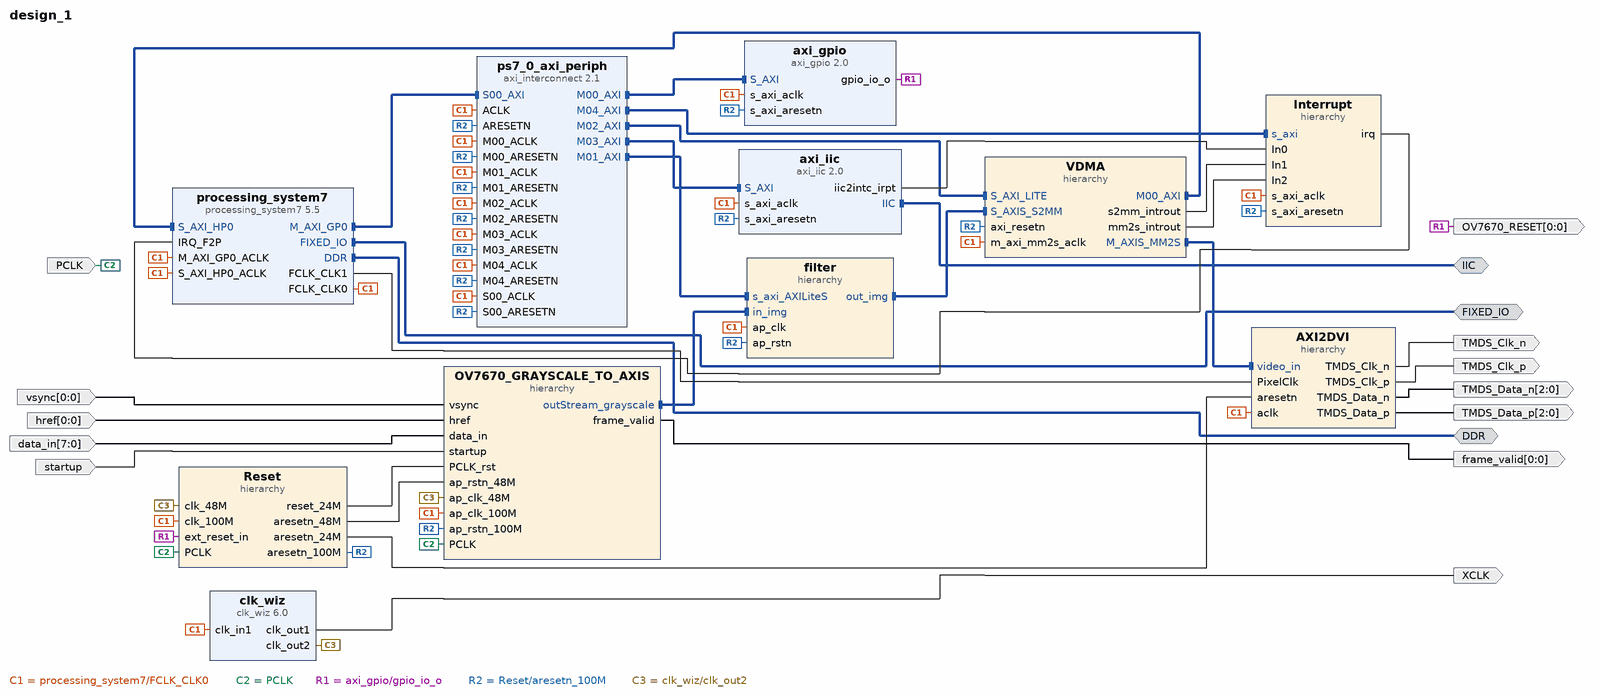
[diagram p0: block diagram of the top level]
# Vivado block design design_1, xc7z020clg400-1, Vivado 2019.1
create_bd_design design_1

create_bd_intf_port -mode Master -vlnv xilinx.com:interface:ddrx_rtl:1.0 DDR
create_bd_intf_port -mode Master -vlnv xilinx.com:display_processing_system7:fixedio_rtl:1.0 FIXED_IO
create_bd_intf_port -mode Master -vlnv xilinx.com:interface:iic_rtl:1.0 IIC
create_bd_port -dir O -type clk TMDS_Clk_p
create_bd_port -dir O -type clk TMDS_Clk_n
create_bd_port -dir O -from 2 -to 0 TMDS_Data_p
create_bd_port -dir O -from 2 -to 0 TMDS_Data_n
create_bd_port -dir O -type clk XCLK
set_property -dict {CONFIG.FREQ_HZ 24000000} [get_bd_ports XCLK]
create_bd_port -dir I -from 0 -to 0 -type data vsync
set_property -dict [list \
  CONFIG.LAYERED_METADATA {xilinx.com:interface:datatypes:1.0 {DATA {datatype {name {attribs {resolve_type immediate dependency {} format string minimum {} maximum {}} value {}} bitwidth {attribs {resolve_type immediate dependency {} format long minimum {} maximum {}} value 1} bitoffset {attribs {resolve_type immediate dependency {} format long minimum {} maximum {}} value 0} integer {signed {attribs {resolve_type immediate dependency {} format bool minimum {} maximum {}} value false}}}}}} \
] [get_bd_ports vsync]
create_bd_port -dir I -from 0 -to 0 -type data href
set_property -dict [list \
  CONFIG.LAYERED_METADATA {xilinx.com:interface:datatypes:1.0 {DATA {datatype {name {attribs {resolve_type immediate dependency {} format string minimum {} maximum {}} value {}} bitwidth {attribs {resolve_type immediate dependency {} format long minimum {} maximum {}} value 1} bitoffset {attribs {resolve_type immediate dependency {} format long minimum {} maximum {}} value 0} integer {signed {attribs {resolve_type immediate dependency {} format bool minimum {} maximum {}} value false}}}}}} \
] [get_bd_ports href]
create_bd_port -dir I -from 7 -to 0 -type data data_in
set_property -dict [list \
  CONFIG.LAYERED_METADATA {xilinx.com:interface:datatypes:1.0 {DATA {datatype {name {attribs {resolve_type immediate dependency {} format string minimum {} maximum {}} value {}} bitwidth {attribs {resolve_type immediate dependency {} format long minimum {} maximum {}} value 8} bitoffset {attribs {resolve_type immediate dependency {} format long minimum {} maximum {}} value 0} integer {signed {attribs {resolve_type immediate dependency {} format bool minimum {} maximum {}} value false}}}}}} \
] [get_bd_ports data_in]
create_bd_port -dir I -type clk PCLK
set_property -dict {CONFIG.FREQ_HZ 24000000} [get_bd_ports PCLK]
create_bd_port -dir O -from 0 -to 0 OV7670_RESET
create_bd_port -dir O -from 0 -to 0 -type data frame_valid
create_bd_port -dir I -type rst startup
set_property -dict {CONFIG.POLARITY ACTIVE_LOW} [get_bd_ports startup]

create_bd_cell -type ip -vlnv xilinx.com:ip:processing_system7:5.5 processing_system7
set_property -dict [list \
  CONFIG.PCW_APU_PERIPHERAL_FREQMHZ 650 \
  CONFIG.PCW_CRYSTAL_PERIPHERAL_FREQMHZ 50 \
  CONFIG.PCW_ENET0_ENET0_IO {MIO 16 .. 27} \
  CONFIG.PCW_ENET0_GRP_MDIO_ENABLE 1 \
  CONFIG.PCW_ENET0_GRP_MDIO_IO {MIO 52 .. 53} \
  CONFIG.PCW_ENET0_PERIPHERAL_ENABLE 1 \
  CONFIG.PCW_ENET0_RESET_ENABLE 1 \
  CONFIG.PCW_ENET0_RESET_IO {MIO 9} \
  CONFIG.PCW_ENET_RESET_ENABLE 1 \
  CONFIG.PCW_ENET_RESET_SELECT {Share reset pin} \
  CONFIG.PCW_EN_CLK1_PORT 1 \
  CONFIG.PCW_FPGA0_PERIPHERAL_FREQMHZ 100 \
  CONFIG.PCW_FPGA1_PERIPHERAL_FREQMHZ 40 \
  CONFIG.PCW_FPGA_FCLK1_ENABLE 1 \
  CONFIG.PCW_GPIO_MIO_GPIO_ENABLE 1 \
  CONFIG.PCW_GPIO_MIO_GPIO_IO MIO \
  CONFIG.PCW_I2C_RESET_ENABLE 1 \
  CONFIG.PCW_IRQ_F2P_INTR 1 \
  CONFIG.PCW_M_AXI_GP0_FREQMHZ 10 \
  CONFIG.PCW_PERIPHERAL_BOARD_PRESET part0 \
  CONFIG.PCW_PRESET_BANK1_VOLTAGE {LVCMOS 1.8V} \
  CONFIG.PCW_QSPI_GRP_FBCLK_ENABLE 1 \
  CONFIG.PCW_QSPI_GRP_FBCLK_IO {MIO 8} \
  CONFIG.PCW_QSPI_GRP_SINGLE_SS_ENABLE 1 \
  CONFIG.PCW_QSPI_GRP_SINGLE_SS_IO {MIO 1 .. 6} \
  CONFIG.PCW_QSPI_PERIPHERAL_ENABLE 1 \
  CONFIG.PCW_QSPI_QSPI_IO {MIO 1 .. 6} \
  CONFIG.PCW_SD0_GRP_CD_ENABLE 1 \
  CONFIG.PCW_SD0_GRP_CD_IO {MIO 47} \
  CONFIG.PCW_SD0_GRP_WP_ENABLE 0 \
  CONFIG.PCW_SD0_PERIPHERAL_ENABLE 1 \
  CONFIG.PCW_SD0_SD0_IO {MIO 40 .. 45} \
  CONFIG.PCW_SDIO_PERIPHERAL_FREQMHZ 50 \
  CONFIG.PCW_SINGLE_QSPI_DATA_MODE x4 \
  CONFIG.PCW_S_AXI_HP0_FREQMHZ 10 \
  CONFIG.PCW_UART0_PERIPHERAL_ENABLE 1 \
  CONFIG.PCW_UART0_UART0_IO {MIO 14 .. 15} \
  CONFIG.PCW_UART1_PERIPHERAL_ENABLE 0 \
  CONFIG.PCW_UART_PERIPHERAL_FREQMHZ 100 \
  CONFIG.PCW_UIPARAM_DDR_BUS_WIDTH {16 Bit} \
  CONFIG.PCW_UIPARAM_DDR_FREQ_MHZ 525 \
  CONFIG.PCW_UIPARAM_DDR_PARTNO {MT41J256M16 RE-125} \
  CONFIG.PCW_USB0_PERIPHERAL_ENABLE 1 \
  CONFIG.PCW_USB0_RESET_ENABLE 1 \
  CONFIG.PCW_USB0_RESET_IO {MIO 46} \
  CONFIG.PCW_USB0_USB0_IO {MIO 28 .. 39} \
  CONFIG.PCW_USB_RESET_ENABLE 1 \
  CONFIG.PCW_USB_RESET_SELECT {Share reset pin} \
  CONFIG.PCW_USE_FABRIC_INTERRUPT 1 \
  CONFIG.PCW_USE_S_AXI_HP0 1 \
] [get_bd_cells processing_system7]
# 495 more settings of processing_system7 are not shown: defaults, MIO pin electricals, DDR timing, and values the tool derives
create_bd_cell -type ip -vlnv xilinx.com:ip:axi_interconnect:2.1 ps7_0_axi_periph
set_property -dict {CONFIG.NUM_MI 5} [get_bd_cells ps7_0_axi_periph]
create_bd_cell -type hier filter
create_bd_cell -type ip -vlnv xilinx.com:ip:clk_wiz:6.0 clk_wiz
set_property -dict [list \
  CONFIG.CLKOUT1_JITTER 320.117 \
  CONFIG.CLKOUT1_PHASE_ERROR 301.601 \
  CONFIG.CLKOUT1_REQUESTED_OUT_FREQ 24 \
  CONFIG.CLKOUT2_JITTER 281.382 \
  CONFIG.CLKOUT2_PHASE_ERROR 301.601 \
  CONFIG.CLKOUT2_REQUESTED_OUT_FREQ 48.000 \
  CONFIG.CLKOUT2_USED true \
  CONFIG.MMCM_CLKFBOUT_MULT_F 48.000 \
  CONFIG.MMCM_CLKOUT0_DIVIDE_F 40.000 \
  CONFIG.MMCM_CLKOUT1_DIVIDE 20 \
  CONFIG.MMCM_DIVCLK_DIVIDE 5 \
  CONFIG.NUM_OUT_CLKS 2 \
  CONFIG.USE_LOCKED false \
  CONFIG.USE_RESET false \
] [get_bd_cells clk_wiz]
create_bd_cell -type ip -vlnv xilinx.com:ip:axi_gpio:2.0 axi_gpio
set_property -dict {CONFIG.C_ALL_OUTPUTS 1 CONFIG.C_DOUT_DEFAULT 0x00000001 CONFIG.C_GPIO_WIDTH 1} [get_bd_cells axi_gpio]
create_bd_cell -type hier Interrupt
create_bd_cell -type hier AXI2DVI
create_bd_cell -type hier OV7670_GRAYSCALE_TO_AXIS
create_bd_cell -type ip -vlnv xilinx.com:ip:axi_iic:2.0 axi_iic
set_property -dict {CONFIG.IIC_BOARD_INTERFACE Custom CONFIG.USE_BOARD_FLOW true} [get_bd_cells axi_iic]
create_bd_cell -type hier Reset
create_bd_cell -type hier VDMA

# ---- hierarchy /filter ----
current_bd_instance /filter
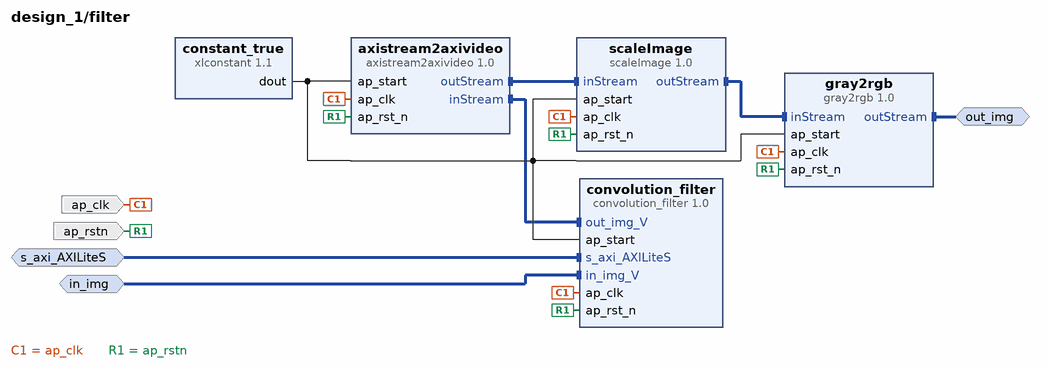
[diagram p1: block diagram inside /filter]
create_bd_intf_pin -mode Slave -vlnv xilinx.com:interface:aximm_rtl:1.0 s_axi_AXILiteS
create_bd_intf_pin -mode Slave -vlnv xilinx.com:interface:axis_rtl:1.0 in_img
create_bd_intf_pin -mode Master -vlnv xilinx.com:interface:axis_rtl:1.0 out_img
create_bd_pin -dir I -type clk ap_clk
create_bd_pin -dir I -type rst ap_rstn

create_bd_cell -type ip -vlnv xilinx.com:ip:xlconstant:1.1 constant_true
create_bd_cell -type ip -vlnv xilinx.com:hls:scaleImage:1.0 scaleImage
create_bd_cell -type ip -vlnv xilinx.com:hls:gray2rgb:1.0 gray2rgb
create_bd_cell -type ip -vlnv xilinx.com:hls:axistream2axivideo:1.0 axistream2axivideo
create_bd_cell -type ip -vlnv xilinx.com:hls:convolution_filter:1.0 convolution_filter

# ---- hierarchy /Interrupt ----
current_bd_instance /Interrupt
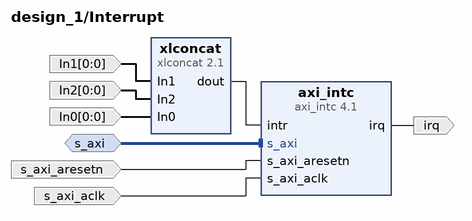
[diagram p2: block diagram inside /Interrupt]
create_bd_intf_pin -mode Slave -vlnv xilinx.com:interface:aximm_rtl:1.0 s_axi
create_bd_pin -dir I -type rst s_axi_aresetn
create_bd_pin -dir O irq
create_bd_pin -dir I -type clk s_axi_aclk
create_bd_pin -dir I -from 0 -to 0 In1
create_bd_pin -dir I -from 0 -to 0 In2
create_bd_pin -dir I -from 0 -to 0 In0

create_bd_cell -type ip -vlnv xilinx.com:ip:axi_intc:4.1 axi_intc
create_bd_cell -type ip -vlnv xilinx.com:ip:xlconcat:2.1 xlconcat
set_property -dict {CONFIG.NUM_PORTS 3} [get_bd_cells xlconcat]

# ---- hierarchy /AXI2DVI ----
current_bd_instance /AXI2DVI
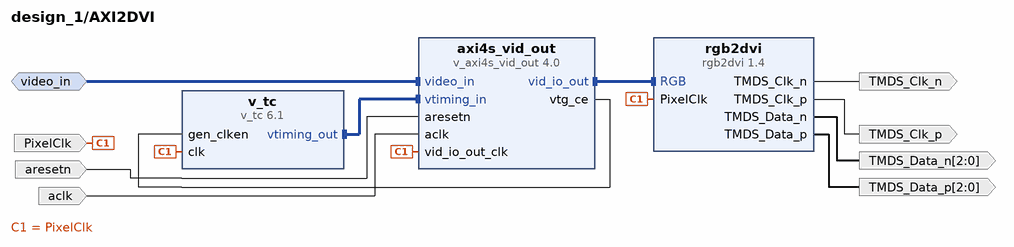
[diagram p3: block diagram inside /AXI2DVI]
create_bd_intf_pin -mode Slave -vlnv xilinx.com:interface:axis_rtl:1.0 video_in
create_bd_pin -dir I -type clk PixelClk
create_bd_pin -dir O -type clk TMDS_Clk_n
create_bd_pin -dir O -from 2 -to 0 TMDS_Data_p
create_bd_pin -dir O -from 2 -to 0 TMDS_Data_n
create_bd_pin -dir O -type clk TMDS_Clk_p
create_bd_pin -dir I -type rst aresetn
create_bd_pin -dir I -type clk aclk

create_bd_cell -type ip -vlnv digilentinc.com:ip:rgb2dvi:1.4 rgb2dvi
set_property -dict {CONFIG.kClkRange 3} [get_bd_cells rgb2dvi]
create_bd_cell -type ip -vlnv xilinx.com:ip:v_axi4s_vid_out:4.0 axi4s_vid_out
set_property -dict [list \
  CONFIG.C_ADDR_WIDTH 10 \
  CONFIG.C_HAS_ASYNC_CLK 1 \
  CONFIG.C_HYSTERESIS_LEVEL 1023 \
  CONFIG.C_S_AXIS_VIDEO_FORMAT 2 \
] [get_bd_cells axi4s_vid_out]
create_bd_cell -type ip -vlnv xilinx.com:ip:v_tc:6.1 v_tc
set_property -dict [list \
  CONFIG.HAS_AXI4_LITE false \
  CONFIG.VIDEO_MODE 800x600p \
  CONFIG.enable_detection false \
  CONFIG.max_clocks_per_line 2048 \
  CONFIG.max_lines_per_frame 2048 \
] [get_bd_cells v_tc]

# ---- hierarchy /OV7670_GRAYSCALE_TO_AXIS ----
current_bd_instance /OV7670_GRAYSCALE_TO_AXIS
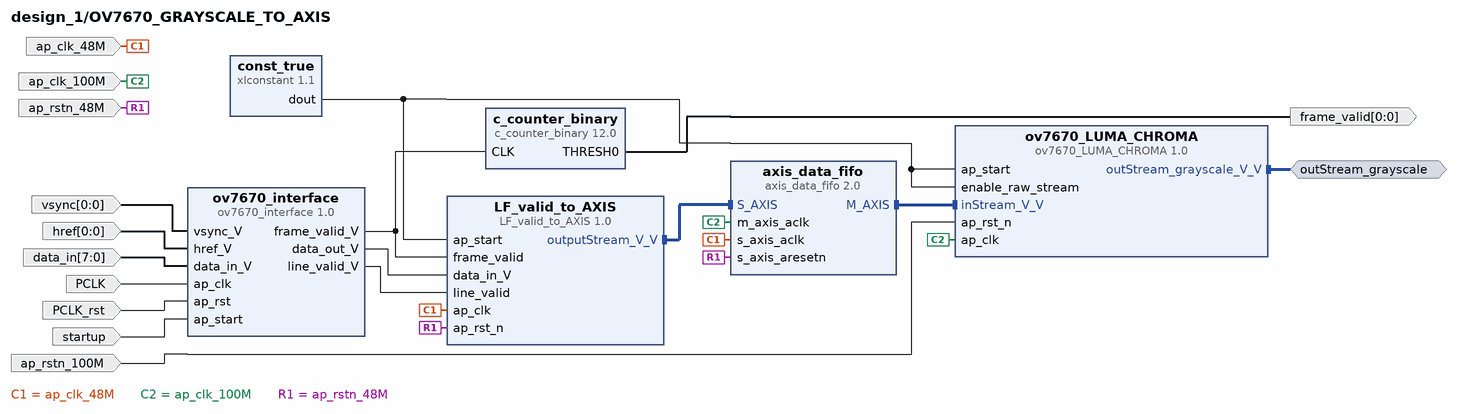
[diagram p4: block diagram inside /OV7670_GRAYSCALE_TO_AXIS]
create_bd_intf_pin -mode Master -vlnv xilinx.com:interface:axis_rtl:1.0 outStream_grayscale
create_bd_pin -dir I -from 0 -to 0 -type data vsync
create_bd_pin -dir I -from 0 -to 0 -type data href
create_bd_pin -dir I -from 7 -to 0 -type data data_in
create_bd_pin -dir I -type rst PCLK_rst
create_bd_pin -dir O -from 0 -to 0 -type data frame_valid
create_bd_pin -dir I -type clk PCLK
create_bd_pin -dir I -type clk ap_clk_48M
create_bd_pin -dir I -type clk ap_clk_100M
create_bd_pin -dir I -type rst ap_rstn_100M
create_bd_pin -dir I -type rst ap_rstn_48M
create_bd_pin -dir I startup

create_bd_cell -type ip -vlnv xilinx.com:ip:xlconstant:1.1 const_true
create_bd_cell -type ip -vlnv xilinx.com:ip:c_counter_binary:12.0 c_counter_binary
set_property -dict [list \
  CONFIG.Output_Width 4 \
  CONFIG.Sync_Threshold_Output true \
  CONFIG.Threshold_Value F \
] [get_bd_cells c_counter_binary]
create_bd_cell -type ip -vlnv xilinx.com:hls:ov7670_interface:1.0 ov7670_interface
create_bd_cell -type ip -vlnv xilinx.com:hls:LF_valid_to_AXIS:1.0 LF_valid_to_AXIS
create_bd_cell -type ip -vlnv xilinx.com:ip:axis_data_fifo:2.0 axis_data_fifo
set_property -dict {CONFIG.FIFO_DEPTH 2048 CONFIG.IS_ACLK_ASYNC 1 CONFIG.SYNCHRONIZATION_STAGES 2} [get_bd_cells axis_data_fifo]
create_bd_cell -type ip -vlnv xilinx.com:hls:ov7670_LUMA_CHROMA:1.0 ov7670_LUMA_CHROMA

# ---- hierarchy /Reset ----
current_bd_instance /Reset
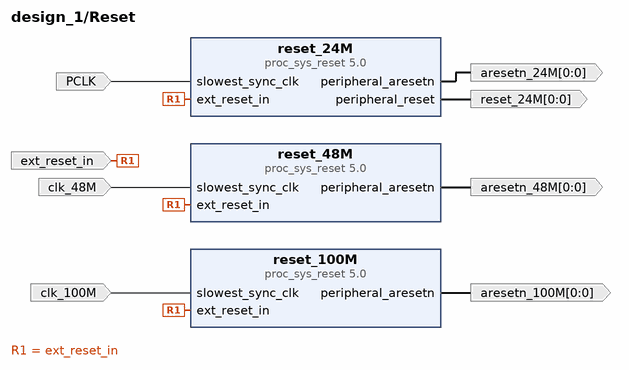
[diagram p5: block diagram inside /Reset]
create_bd_pin -dir O -from 0 -to 0 -type rst aresetn_100M
create_bd_pin -dir I -type clk clk_100M
create_bd_pin -dir I -type clk PCLK
create_bd_pin -dir O -from 0 -to 0 -type rst aresetn_24M
create_bd_pin -dir O -from 0 -to 0 -type rst reset_24M
create_bd_pin -dir I -type rst ext_reset_in
create_bd_pin -dir I -type clk clk_48M
create_bd_pin -dir O -from 0 -to 0 -type rst aresetn_48M

create_bd_cell -type ip -vlnv xilinx.com:ip:proc_sys_reset:5.0 reset_24M
create_bd_cell -type ip -vlnv xilinx.com:ip:proc_sys_reset:5.0 reset_100M
create_bd_cell -type ip -vlnv xilinx.com:ip:proc_sys_reset:5.0 reset_48M

# ---- hierarchy /VDMA ----
current_bd_instance /VDMA
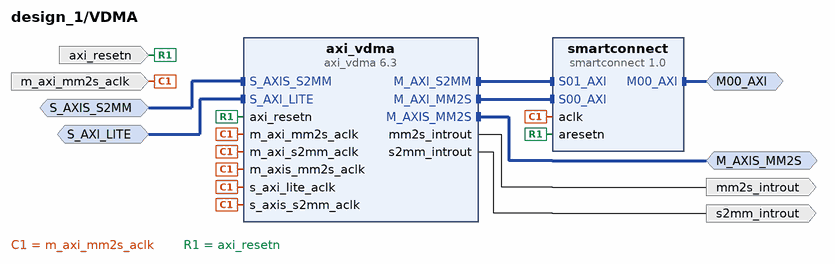
[diagram p6: block diagram inside /VDMA]
create_bd_intf_pin -mode Slave -vlnv xilinx.com:interface:aximm_rtl:1.0 S_AXI_LITE
create_bd_intf_pin -mode Slave -vlnv xilinx.com:interface:axis_rtl:1.0 S_AXIS_S2MM
create_bd_intf_pin -mode Master -vlnv xilinx.com:interface:axis_rtl:1.0 M_AXIS_MM2S
create_bd_intf_pin -mode Master -vlnv xilinx.com:interface:aximm_rtl:1.0 M00_AXI
create_bd_pin -dir I -type clk m_axi_mm2s_aclk
create_bd_pin -dir O -type intr s2mm_introut
create_bd_pin -dir O -type intr mm2s_introut
create_bd_pin -dir I -type rst axi_resetn

create_bd_cell -type ip -vlnv xilinx.com:ip:axi_vdma:6.3 axi_vdma
set_property -dict [list \
  CONFIG.c_include_mm2s_dre 1 \
  CONFIG.c_include_s2mm_dre 1 \
  CONFIG.c_m_axis_mm2s_tdata_width 24 \
  CONFIG.c_mm2s_genlock_mode 3 \
  CONFIG.c_mm2s_linebuffer_depth 1024 \
  CONFIG.c_num_fstores 3 \
  CONFIG.c_s2mm_genlock_mode 2 \
  CONFIG.c_s2mm_linebuffer_depth 1024 \
  CONFIG.c_use_s2mm_fsync 2 \
] [get_bd_cells axi_vdma]
create_bd_cell -type ip -vlnv xilinx.com:ip:smartconnect:1.0 smartconnect

# ---- connections ----

current_bd_instance /filter
connect_bd_intf_net [get_bd_intf_pins scaleImage/outStream] [get_bd_intf_pins gray2rgb/inStream]
connect_bd_intf_net [get_bd_intf_pins s_axi_AXILiteS] [get_bd_intf_pins convolution_filter/s_axi_AXILiteS]
connect_bd_intf_net [get_bd_intf_pins axistream2axivideo/outStream] [get_bd_intf_pins scaleImage/inStream]
connect_bd_intf_net [get_bd_intf_pins out_img] [get_bd_intf_pins gray2rgb/outStream]
connect_bd_intf_net [get_bd_intf_pins in_img] [get_bd_intf_pins convolution_filter/in_img_V]
connect_bd_intf_net [get_bd_intf_pins axistream2axivideo/inStream] [get_bd_intf_pins convolution_filter/out_img_V]
connect_bd_net [get_bd_pins constant_true/dout] \
  [get_bd_pins scaleImage/ap_start] [get_bd_pins gray2rgb/ap_start] [get_bd_pins axistream2axivideo/ap_start] \
  [get_bd_pins convolution_filter/ap_start]
connect_bd_net [get_bd_pins ap_clk] \
  [get_bd_pins scaleImage/ap_clk] [get_bd_pins gray2rgb/ap_clk] [get_bd_pins axistream2axivideo/ap_clk] \
  [get_bd_pins convolution_filter/ap_clk]
connect_bd_net -net ap_rst_n_1 [get_bd_pins ap_rstn] \
  [get_bd_pins scaleImage/ap_rst_n] [get_bd_pins gray2rgb/ap_rst_n] [get_bd_pins axistream2axivideo/ap_rst_n] \
  [get_bd_pins convolution_filter/ap_rst_n]

current_bd_instance /Interrupt
connect_bd_intf_net [get_bd_intf_pins s_axi] [get_bd_intf_pins axi_intc/s_axi]
connect_bd_net [get_bd_pins s_axi_aresetn] [get_bd_pins axi_intc/s_axi_aresetn]
connect_bd_net -net axi_intc_0_irq [get_bd_pins axi_intc/irq] [get_bd_pins irq]
connect_bd_net [get_bd_pins s_axi_aclk] [get_bd_pins axi_intc/s_axi_aclk]
connect_bd_net -net xlconcat_0_dout [get_bd_pins xlconcat/dout] [get_bd_pins axi_intc/intr]
connect_bd_net -net In1_1 [get_bd_pins In1] [get_bd_pins xlconcat/In1]
connect_bd_net -net In2_0_1 [get_bd_pins In2] [get_bd_pins xlconcat/In2]
connect_bd_net -net In0_1 [get_bd_pins In0] [get_bd_pins xlconcat/In0]

current_bd_instance /AXI2DVI
connect_bd_intf_net [get_bd_intf_pins video_in] [get_bd_intf_pins axi4s_vid_out/video_in]
connect_bd_intf_net [get_bd_intf_pins axi4s_vid_out/vtiming_in] [get_bd_intf_pins v_tc/vtiming_out]
connect_bd_intf_net [get_bd_intf_pins rgb2dvi/RGB] [get_bd_intf_pins axi4s_vid_out/vid_io_out]
connect_bd_net [get_bd_pins PixelClk] [get_bd_pins rgb2dvi/PixelClk] [get_bd_pins axi4s_vid_out/vid_io_out_clk] [get_bd_pins v_tc/clk]
connect_bd_net [get_bd_pins rgb2dvi/TMDS_Clk_n] [get_bd_pins TMDS_Clk_n]
connect_bd_net [get_bd_pins rgb2dvi/TMDS_Data_p] [get_bd_pins TMDS_Data_p]
connect_bd_net [get_bd_pins rgb2dvi/TMDS_Data_n] [get_bd_pins TMDS_Data_n]
connect_bd_net [get_bd_pins rgb2dvi/TMDS_Clk_p] [get_bd_pins TMDS_Clk_p]
connect_bd_net [get_bd_pins aresetn] [get_bd_pins axi4s_vid_out/aresetn]
connect_bd_net [get_bd_pins aclk] [get_bd_pins axi4s_vid_out/aclk]
connect_bd_net [get_bd_pins axi4s_vid_out/vtg_ce] [get_bd_pins v_tc/gen_clken]

current_bd_instance /OV7670_GRAYSCALE_TO_AXIS
connect_bd_intf_net -intf_net axis_data_fifo_0_M_AXIS [get_bd_intf_pins ov7670_LUMA_CHROMA/inStream_V_V] [get_bd_intf_pins axis_data_fifo/M_AXIS]
connect_bd_intf_net [get_bd_intf_pins outStream_grayscale] [get_bd_intf_pins ov7670_LUMA_CHROMA/outStream_grayscale_V_V]
connect_bd_intf_net [get_bd_intf_pins LF_valid_to_AXIS/outputStream_V_V] [get_bd_intf_pins axis_data_fifo/S_AXIS]
connect_bd_net [get_bd_pins const_true/dout] \
  [get_bd_pins LF_valid_to_AXIS/ap_start] [get_bd_pins ov7670_LUMA_CHROMA/ap_start] \
  [get_bd_pins ov7670_LUMA_CHROMA/enable_raw_stream]
connect_bd_net -net vsync_V_0_1 [get_bd_pins vsync] [get_bd_pins ov7670_interface/vsync_V]
connect_bd_net -net href_V_0_1 [get_bd_pins href] [get_bd_pins ov7670_interface/href_V]
connect_bd_net -net data_in_V_0_1 [get_bd_pins data_in] [get_bd_pins ov7670_interface/data_in_V]
connect_bd_net -net ap_clk_0_1 [get_bd_pins PCLK] [get_bd_pins ov7670_interface/ap_clk]
connect_bd_net -net ov7670_interface_0_frame_valid_V [get_bd_pins ov7670_interface/frame_valid_V] \
  [get_bd_pins c_counter_binary/CLK] [get_bd_pins LF_valid_to_AXIS/frame_valid]
connect_bd_net -net c_counter_binary_0_THRESH0 [get_bd_pins c_counter_binary/THRESH0] [get_bd_pins frame_valid]
connect_bd_net -net ap_clk_1 [get_bd_pins ap_clk_48M] [get_bd_pins LF_valid_to_AXIS/ap_clk] [get_bd_pins axis_data_fifo/s_axis_aclk]
connect_bd_net -net ov7670_interface_0_data_out_V [get_bd_pins ov7670_interface/data_out_V] [get_bd_pins LF_valid_to_AXIS/data_in_V]
connect_bd_net -net ov7670_interface_0_line_valid_V [get_bd_pins ov7670_interface/line_valid_V] [get_bd_pins LF_valid_to_AXIS/line_valid]
connect_bd_net -net ap_clk1_1 [get_bd_pins ap_clk_100M] [get_bd_pins axis_data_fifo/m_axis_aclk] [get_bd_pins ov7670_LUMA_CHROMA/ap_clk]
connect_bd_net -net ap_rst_n1_1 [get_bd_pins ap_rstn_100M] [get_bd_pins ov7670_LUMA_CHROMA/ap_rst_n]
connect_bd_net [get_bd_pins ap_rstn_48M] [get_bd_pins LF_valid_to_AXIS/ap_rst_n] [get_bd_pins axis_data_fifo/s_axis_aresetn]
connect_bd_net -net ap_rst_0_1 [get_bd_pins PCLK_rst] [get_bd_pins ov7670_interface/ap_rst]
connect_bd_net [get_bd_pins startup] [get_bd_pins ov7670_interface/ap_start]

current_bd_instance /Reset
connect_bd_net [get_bd_pins reset_100M/peripheral_aresetn] [get_bd_pins aresetn_100M]
connect_bd_net -net slowest_sync_clk_1 [get_bd_pins clk_100M] [get_bd_pins reset_100M/slowest_sync_clk]
connect_bd_net [get_bd_pins PCLK] [get_bd_pins reset_24M/slowest_sync_clk]
connect_bd_net [get_bd_pins reset_24M/peripheral_aresetn] [get_bd_pins aresetn_24M]
connect_bd_net [get_bd_pins reset_24M/peripheral_reset] [get_bd_pins reset_24M]
connect_bd_net [get_bd_pins ext_reset_in] \
  [get_bd_pins reset_100M/ext_reset_in] [get_bd_pins reset_24M/ext_reset_in] [get_bd_pins reset_48M/ext_reset_in]
connect_bd_net -net slowest_sync_clk1_1 [get_bd_pins clk_48M] [get_bd_pins reset_48M/slowest_sync_clk]
connect_bd_net [get_bd_pins reset_48M/peripheral_aresetn] [get_bd_pins aresetn_48M]

current_bd_instance /VDMA
connect_bd_intf_net [get_bd_intf_pins M_AXIS_MM2S] [get_bd_intf_pins axi_vdma/M_AXIS_MM2S]
connect_bd_intf_net [get_bd_intf_pins S_AXIS_S2MM] [get_bd_intf_pins axi_vdma/S_AXIS_S2MM]
connect_bd_intf_net [get_bd_intf_pins M00_AXI] [get_bd_intf_pins smartconnect/M00_AXI]
connect_bd_intf_net [get_bd_intf_pins S_AXI_LITE] [get_bd_intf_pins axi_vdma/S_AXI_LITE]
connect_bd_intf_net [get_bd_intf_pins axi_vdma/M_AXI_S2MM] [get_bd_intf_pins smartconnect/S01_AXI]
connect_bd_intf_net [get_bd_intf_pins axi_vdma/M_AXI_MM2S] [get_bd_intf_pins smartconnect/S00_AXI]
connect_bd_net [get_bd_pins m_axi_mm2s_aclk] \
  [get_bd_pins axi_vdma/m_axi_mm2s_aclk] [get_bd_pins axi_vdma/m_axis_mm2s_aclk] [get_bd_pins axi_vdma/m_axi_s2mm_aclk] \
  [get_bd_pins axi_vdma/s_axis_s2mm_aclk] [get_bd_pins axi_vdma/s_axi_lite_aclk] [get_bd_pins smartconnect/aclk]
connect_bd_net [get_bd_pins axi_vdma/s2mm_introut] [get_bd_pins s2mm_introut]
connect_bd_net [get_bd_pins axi_vdma/mm2s_introut] [get_bd_pins mm2s_introut]
connect_bd_net [get_bd_pins axi_resetn] [get_bd_pins axi_vdma/axi_resetn] [get_bd_pins smartconnect/aresetn]

current_bd_instance /
connect_bd_intf_net -intf_net OV7670_GRAYSCALE_TO_AXIS_outStream_grayscale_V_V [get_bd_intf_pins OV7670_GRAYSCALE_TO_AXIS/outStream_grayscale] [get_bd_intf_pins filter/in_img]
connect_bd_intf_net [get_bd_intf_pins ps7_0_axi_periph/M01_AXI] [get_bd_intf_pins filter/s_axi_AXILiteS]
connect_bd_intf_net -intf_net processing_system7_0_M_AXI_GP0 [get_bd_intf_pins processing_system7/M_AXI_GP0] [get_bd_intf_pins ps7_0_axi_periph/S00_AXI]
connect_bd_intf_net [get_bd_intf_pins ps7_0_axi_periph/M04_AXI] [get_bd_intf_pins Interrupt/s_axi]
connect_bd_intf_net -intf_net processing_system7_0_FIXED_IO [get_bd_intf_ports FIXED_IO] [get_bd_intf_pins processing_system7/FIXED_IO]
connect_bd_intf_net [get_bd_intf_pins ps7_0_axi_periph/M02_AXI] [get_bd_intf_pins VDMA/S_AXI_LITE]
connect_bd_intf_net -intf_net processing_system7_0_DDR [get_bd_intf_ports DDR] [get_bd_intf_pins processing_system7/DDR]
connect_bd_intf_net [get_bd_intf_pins ps7_0_axi_periph/M03_AXI] [get_bd_intf_pins axi_iic/S_AXI]
connect_bd_intf_net [get_bd_intf_pins ps7_0_axi_periph/M00_AXI] [get_bd_intf_pins axi_gpio/S_AXI]
connect_bd_intf_net [get_bd_intf_pins AXI2DVI/video_in] [get_bd_intf_pins VDMA/M_AXIS_MM2S]
connect_bd_intf_net [get_bd_intf_pins processing_system7/S_AXI_HP0] [get_bd_intf_pins VDMA/M00_AXI]
connect_bd_intf_net -intf_net axi_iic_0_IIC [get_bd_intf_ports IIC] [get_bd_intf_pins axi_iic/IIC]
connect_bd_intf_net -intf_net filter_outStream [get_bd_intf_pins filter/out_img] [get_bd_intf_pins VDMA/S_AXIS_S2MM]
connect_bd_net -net processing_system7_0_FCLK_CLK0 [get_bd_pins processing_system7/FCLK_CLK0] \
  [get_bd_pins processing_system7/M_AXI_GP0_ACLK] [get_bd_pins ps7_0_axi_periph/M00_ACLK] [get_bd_pins ps7_0_axi_periph/ACLK] \
  [get_bd_pins processing_system7/S_AXI_HP0_ACLK] [get_bd_pins ps7_0_axi_periph/M02_ACLK] \
  [get_bd_pins ps7_0_axi_periph/M03_ACLK] [get_bd_pins ps7_0_axi_periph/M04_ACLK] [get_bd_pins axi_gpio/s_axi_aclk] \
  [get_bd_pins clk_wiz/clk_in1] [get_bd_pins Interrupt/s_axi_aclk] [get_bd_pins AXI2DVI/aclk] \
  [get_bd_pins axi_iic/s_axi_aclk] [get_bd_pins ps7_0_axi_periph/S00_ACLK] [get_bd_pins ps7_0_axi_periph/M01_ACLK] \
  [get_bd_pins OV7670_GRAYSCALE_TO_AXIS/ap_clk_100M] [get_bd_pins filter/ap_clk] [get_bd_pins Reset/clk_100M] \
  [get_bd_pins VDMA/m_axi_mm2s_aclk]
connect_bd_net -net rst_ps7_0_100M_peripheral_aresetn [get_bd_pins Reset/aresetn_24M] [get_bd_pins AXI2DVI/aresetn]
connect_bd_net -net processing_system7_0_FCLK_CLK1 [get_bd_pins processing_system7/FCLK_CLK1] [get_bd_pins AXI2DVI/PixelClk]
connect_bd_net -net clk_wiz_0_clk_out1 [get_bd_pins clk_wiz/clk_out1] [get_bd_ports XCLK]
connect_bd_net -net I2C_irq [get_bd_pins Interrupt/irq] [get_bd_pins processing_system7/IRQ_F2P]
connect_bd_net [get_bd_pins AXI2DVI/TMDS_Clk_n] [get_bd_ports TMDS_Clk_n]
connect_bd_net [get_bd_pins AXI2DVI/TMDS_Data_p] [get_bd_ports TMDS_Data_p]
connect_bd_net [get_bd_pins AXI2DVI/TMDS_Data_n] [get_bd_ports TMDS_Data_n]
connect_bd_net [get_bd_pins AXI2DVI/TMDS_Clk_p] [get_bd_ports TMDS_Clk_p]
connect_bd_net -net vsync_V_0_1 [get_bd_ports vsync] [get_bd_pins OV7670_GRAYSCALE_TO_AXIS/vsync]
connect_bd_net -net href_V_0_1 [get_bd_ports href] [get_bd_pins OV7670_GRAYSCALE_TO_AXIS/href]
connect_bd_net -net data_in_V_0_1 [get_bd_ports data_in] [get_bd_pins OV7670_GRAYSCALE_TO_AXIS/data_in]
connect_bd_net -net ap_clk_0_1 [get_bd_ports PCLK] [get_bd_pins OV7670_GRAYSCALE_TO_AXIS/PCLK] [get_bd_pins Reset/PCLK]
connect_bd_net -net axi_gpio_0_gpio_io_o [get_bd_pins axi_gpio/gpio_io_o] [get_bd_ports OV7670_RESET] [get_bd_pins Reset/ext_reset_in]
connect_bd_net -net proc_sys_reset_0_peripheral_aresetn [get_bd_pins Reset/aresetn_100M] \
  [get_bd_pins ps7_0_axi_periph/M04_ARESETN] [get_bd_pins ps7_0_axi_periph/M03_ARESETN] \
  [get_bd_pins ps7_0_axi_periph/M02_ARESETN] [get_bd_pins ps7_0_axi_periph/M00_ARESETN] \
  [get_bd_pins ps7_0_axi_periph/S00_ARESETN] [get_bd_pins ps7_0_axi_periph/ARESETN] [get_bd_pins axi_gpio/s_axi_aresetn] \
  [get_bd_pins Interrupt/s_axi_aresetn] [get_bd_pins axi_iic/s_axi_aresetn] [get_bd_pins ps7_0_axi_periph/M01_ARESETN] \
  [get_bd_pins OV7670_GRAYSCALE_TO_AXIS/ap_rstn_100M] [get_bd_pins filter/ap_rstn] [get_bd_pins VDMA/axi_resetn]
connect_bd_net -net OV7670_GRAYSCALE_TO_AXIS_frame_valid_V_0 [get_bd_pins OV7670_GRAYSCALE_TO_AXIS/frame_valid] [get_bd_ports frame_valid]
connect_bd_net -net axi_iic_0_iic2intc_irpt [get_bd_pins axi_iic/iic2intc_irpt] [get_bd_pins Interrupt/In0]
connect_bd_net [get_bd_pins clk_wiz/clk_out2] [get_bd_pins OV7670_GRAYSCALE_TO_AXIS/ap_clk_48M] [get_bd_pins Reset/clk_48M]
connect_bd_net -net ap_rst_1 [get_bd_pins Reset/reset_24M] [get_bd_pins OV7670_GRAYSCALE_TO_AXIS/PCLK_rst]
connect_bd_net -net In1_1 [get_bd_pins VDMA/s2mm_introut] [get_bd_pins Interrupt/In1]
connect_bd_net -net In2_0_1 [get_bd_pins VDMA/mm2s_introut] [get_bd_pins Interrupt/In2]
connect_bd_net -net ext_reset_in_1_1 [get_bd_ports startup] [get_bd_pins OV7670_GRAYSCALE_TO_AXIS/startup]
connect_bd_net -net Reset_peripheral_aresetn_48M [get_bd_pins Reset/aresetn_48M] [get_bd_pins OV7670_GRAYSCALE_TO_AXIS/ap_rstn_48M]

# ---- address map ----
assign_bd_address -offset 0x41200000 -range 64K -target_address_space [get_bd_addr_spaces processing_system7/Data] [get_bd_addr_segs axi_gpio/S_AXI/Reg]
assign_bd_address -offset 0x41600000 -range 64K -target_address_space [get_bd_addr_spaces processing_system7/Data] [get_bd_addr_segs axi_iic/S_AXI/Reg]
assign_bd_address -offset 0x41800000 -range 64K -target_address_space [get_bd_addr_spaces processing_system7/Data] [get_bd_addr_segs Interrupt/axi_intc/S_AXI/Reg]
assign_bd_address -offset 0x43000000 -range 64K -target_address_space [get_bd_addr_spaces processing_system7/Data] [get_bd_addr_segs VDMA/axi_vdma/S_AXI_LITE/Reg]
assign_bd_address -offset 0x43C10000 -range 64K -target_address_space [get_bd_addr_spaces processing_system7/Data] [get_bd_addr_segs filter/convolution_filter/s_axi_AXILiteS/Reg]
assign_bd_address -offset 0x00000000 -range 512M -target_address_space [get_bd_addr_spaces VDMA/axi_vdma/Data_MM2S] [get_bd_addr_segs processing_system7/S_AXI_HP0/HP0_DDR_LOWOCM]
assign_bd_address -offset 0x00000000 -range 512M -target_address_space [get_bd_addr_spaces VDMA/axi_vdma/Data_S2MM] [get_bd_addr_segs processing_system7/S_AXI_HP0/HP0_DDR_LOWOCM]

validate_bd_design
save_bd_design
